# EAGLE design crossover (EAGLE 7.5.0)
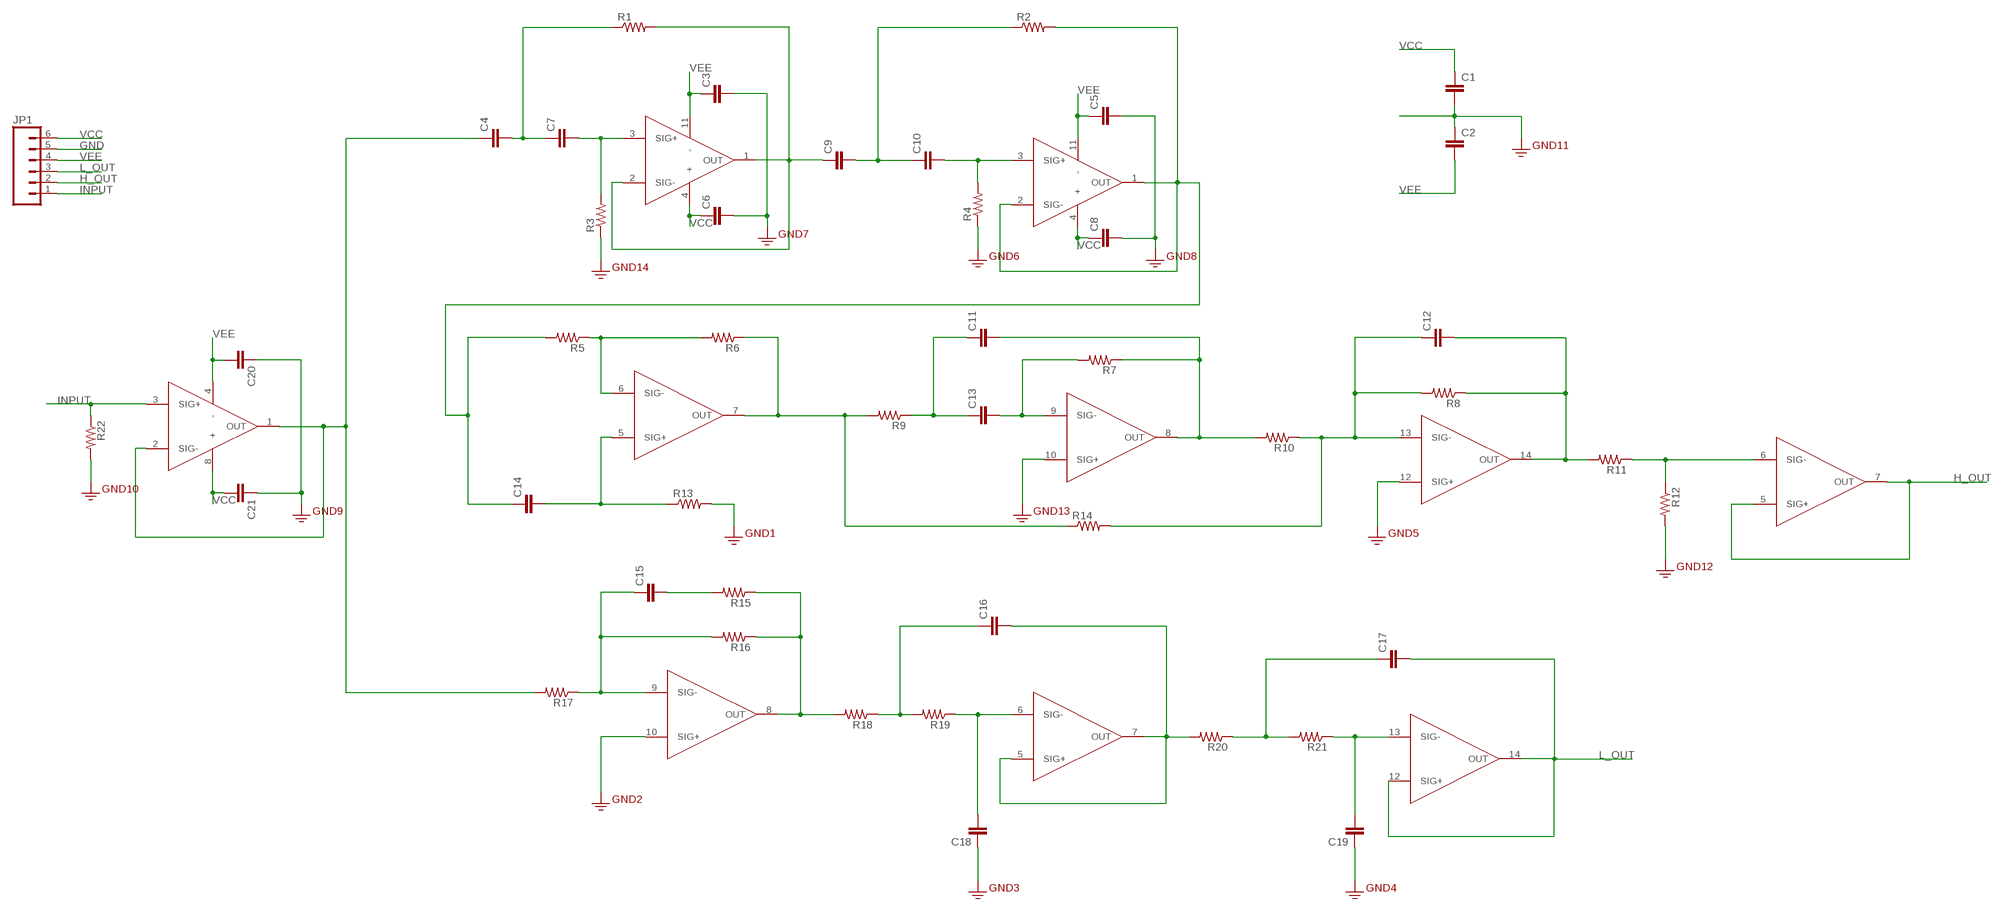
[diagram p0: schematic, sheet 1]

## Parts
C1  CAPEZ  [CAP-PTH-SMALLEZ]
C2  CAPEZ  [CAP-PTH-SMALLEZ]
C3  CAPEZ  [CAP-PTH-SMALLEZ]
C4  CAPEZ  [CAP-PTH-SMALLEZ]
C5  CAPEZ  [CAP-PTH-SMALLEZ]
C6  CAPEZ  [CAP-PTH-SMALLEZ]
C7  CAPEZ  [CAP-PTH-SMALLEZ]
C8  CAPEZ  [CAP-PTH-SMALLEZ]
C9  CAPEZ  [CAP-PTH-SMALLEZ]
C10  CAPEZ  [CAP-PTH-SMALLEZ]
C11  CAPEZ  [CAP-PTH-SMALLEZ]
C12  CAPEZ  [CAP-PTH-SMALLEZ]
C13  CAPEZ  [CAP-PTH-SMALLEZ]
C14  CAPEZ  [CAP-PTH-SMALLEZ]
C15  CAPEZ  [CAP-PTH-SMALLEZ]
C16  CAPEZ  [CAP-PTH-SMALLEZ]
C17  CAPEZ  [CAP-PTH-SMALLEZ]
C18  CAPEZ  [CAP-PTH-SMALLEZ]
C19  CAPEZ  [CAP-PTH-SMALLEZ]
C20  CAPEZ  [CAP-PTH-SMALLEZ]
C21  CAPEZ  [CAP-PTH-SMALLEZ]
JP1  M06SIP  [1X06]
R1  RESISTORPTH-1/4W  [AXIAL-0.4]
R2  RESISTORPTH-1/4W  [AXIAL-0.4]
R3  RESISTORPTH-1/4W  [AXIAL-0.4]
R4  RESISTORPTH-1/4W  [AXIAL-0.4]
R5  RESISTORPTH-1/4W  [AXIAL-0.4]
R6  RESISTORPTH-1/4W  [AXIAL-0.4]
R7  RESISTORPTH-1/4W  [AXIAL-0.4]
R8  RESISTORPTH-1/4W  [AXIAL-0.4]
R9  RESISTORPTH-1/4W  [AXIAL-0.4]
R10  RESISTORPTH-1/4W  [AXIAL-0.4]
R11  RESISTORPTH-1/4W  [AXIAL-0.4]
R12  RESISTORPTH-1/4W  [AXIAL-0.4]
R13  RESISTORPTH-1/4W  [AXIAL-0.4]
R14  RESISTORPTH-1/4W  [AXIAL-0.4]
R15  RESISTORPTH-1/4W  [AXIAL-0.4]
R16  RESISTORPTH-1/4W  [AXIAL-0.4]
R17  RESISTORPTH-1/4W  [AXIAL-0.4]
R18  RESISTORPTH-1/4W  [AXIAL-0.4]
R19  RESISTORPTH-1/4W  [AXIAL-0.4]
R20  RESISTORPTH-1/4W  [AXIAL-0.4]
R21  RESISTORPTH-1/4W  [AXIAL-0.4]
R22  RESISTORPTH-1/4W  [AXIAL-0.4]
U$1  OPA1604STANDARD  [SOIC-14]
U$2  OPA1604STANDARD  [SOIC-14]
U$3  OPA1602  [SOIC8]

## Nets
GND: C1.2 C2.1 C3.2 C5.2 C6.2 C8.2 C18.1 C19.1 C20.1 C21.1 JP1.5 R3.P$1 R4.P$1 R12.P$2 R13.P$2 R22.P$2 U$1.10(SIG+) U$2.10(SIG+) U$2.12(SIG+) ; supply symbol labelled GND2
H_OUT: JP1.2 U$3.5(SIG+) U$3.7(OUT)
INPUT: JP1.1 R22.P$1 U$3.3(SIG+)
L_OUT: C17.2 JP1.3 U$1.12(SIG+) U$1.14(OUT)
N$1: C7.2 R3.P$2 U$1.3(SIG+)
N$2: C9.1 R1.P$2 U$1.1(OUT) U$1.2(SIG-)
N$3: C4.2 C7.1 R1.P$1
N$8: C9.2 C10.1 R2.P$1
N$12: C10.2 R4.P$2 U$2.3(SIG+)
N$15: C11.2 R7.P$1 R10.P$2 U$2.8(OUT)
N$16: C13.2 R7.P$2 U$2.9(SIG-)
N$17: C11.1 C13.1 R9.P$1
N$18: R6.P$1 R9.P$2 R14.P$1 U$2.7(OUT)
N$20: C14.2 R13.P$1 U$2.5(SIG+)
N$21: C14.1 R2.P$2 R5.P$2 U$2.1(OUT) U$2.2(SIG-)
N$22: R5.P$1 R6.P$2 U$2.6(SIG-)
N$23: C12.1 R8.P$2 R10.P$1 R14.P$2 U$2.13(SIG-)
N$25: C12.2 R8.P$1 R11.P$2 U$2.14(OUT)
N$26: R11.P$1 R12.P$1 U$3.6(SIG-)
N$29: C15.1 R16.P$2 R17.P$1 U$1.9(SIG-)
N$30: C15.2 R15.P$2
N$31: R15.P$1 R16.P$1 R18.P$2 U$1.8(OUT)
N$33: C16.1 R18.P$1 R19.P$2
N$34: C18.2 R19.P$1 U$1.6(SIG-)
N$35: C16.2 R20.P$2 U$1.5(SIG+) U$1.7(OUT)
N$36: C17.1 R20.P$1 R21.P$2
N$38: C19.2 R21.P$1 U$1.13(SIG-)
N$42: C4.1 R17.P$2 U$3.1(OUT) U$3.2(SIG-)
VCC: C1.1 C6.1 C8.1 C21.2 JP1.6 U$1.4(+) U$2.4(+) U$3.8(+)
VEE: C2.2 C3.1 C5.1 C20.2 JP1.4 U$1.11(-) U$2.11(-) U$3.4(-)

## Library data of the parts
C1-C21 = SparkFun-Passives:CAP: Capacitor Standard 0603 ceramic capacitor, and 0.1" leaded capacitor.
JP1 = SparkFun-Connectors:M06: Header 6 Standard 6-pin 0.1" header. Use with straight break away headers (SKU : PRT-00116), right angle break away headers (PRT-00553), swiss pins (PRT-00743), machine pins (PRT-00117), and female headers (PRT-00115). Molex polarized connector foot print use with SKU : PRT-08094 with associated crimp pins and housings. NOTES ON THE VARIANTS LOCK and LOCK_LONGPADS... This footprint was designed to help hold the alignment of a through-hole component (i.e. 6-pin header) while soldering it into place. You may notice that each hole has been shifted either up or down by 0.005 of an inch from it's more standard position (which is a perfectly straight line). This slight alteration caused the pins (the squares in the middle) to touch the edges of the holes. Because they are alternating, it causes a "brace" to hold the component in place. 0.005 has proven to be the perfect amount of "off-center" position when using our standard breakaway headers. Although looks a little odd when you look at the bare footprint, once you have a header in there, the alteration is very hard to notice. Also,if you push a header all the way into place, it is covered up entirely on the bottom side. This idea of altering the position of holes to aid alignment will be further integrated into the Sparkfun Library for other footprints. It can help hold any component with 3 or more connection pins.
R1-R22 = SparkFun-Passives:RESISTOR: Resistor Basic schematic elements and footprints for 0603, 1206, and PTH resistors.
U$1 U$2 = NU STEM:OPA1604
U$3 = NU STEM:OPA1602

## Board
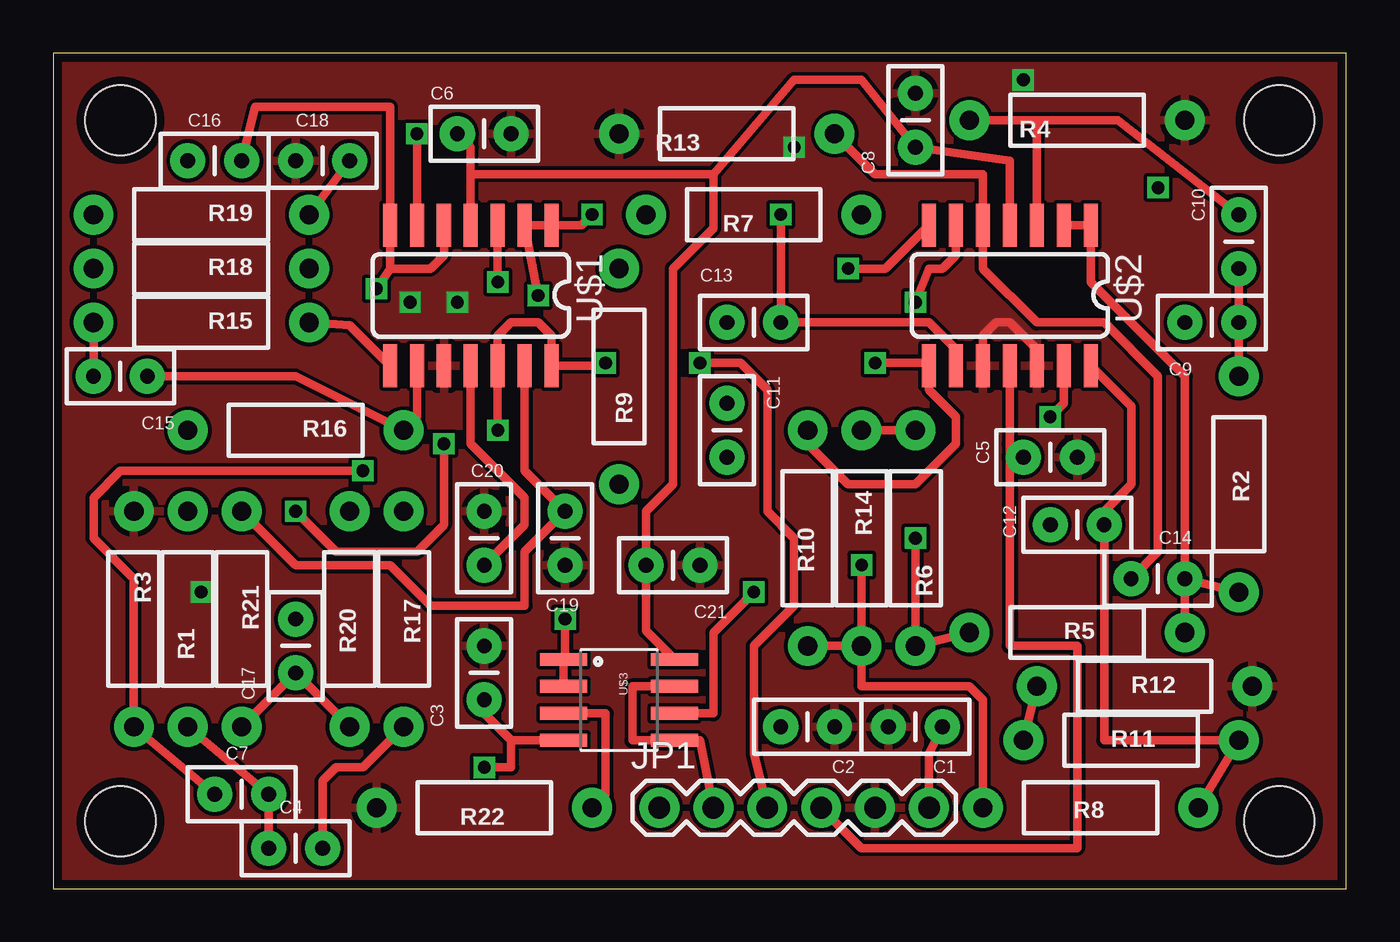
[diagram p1: board, top side]
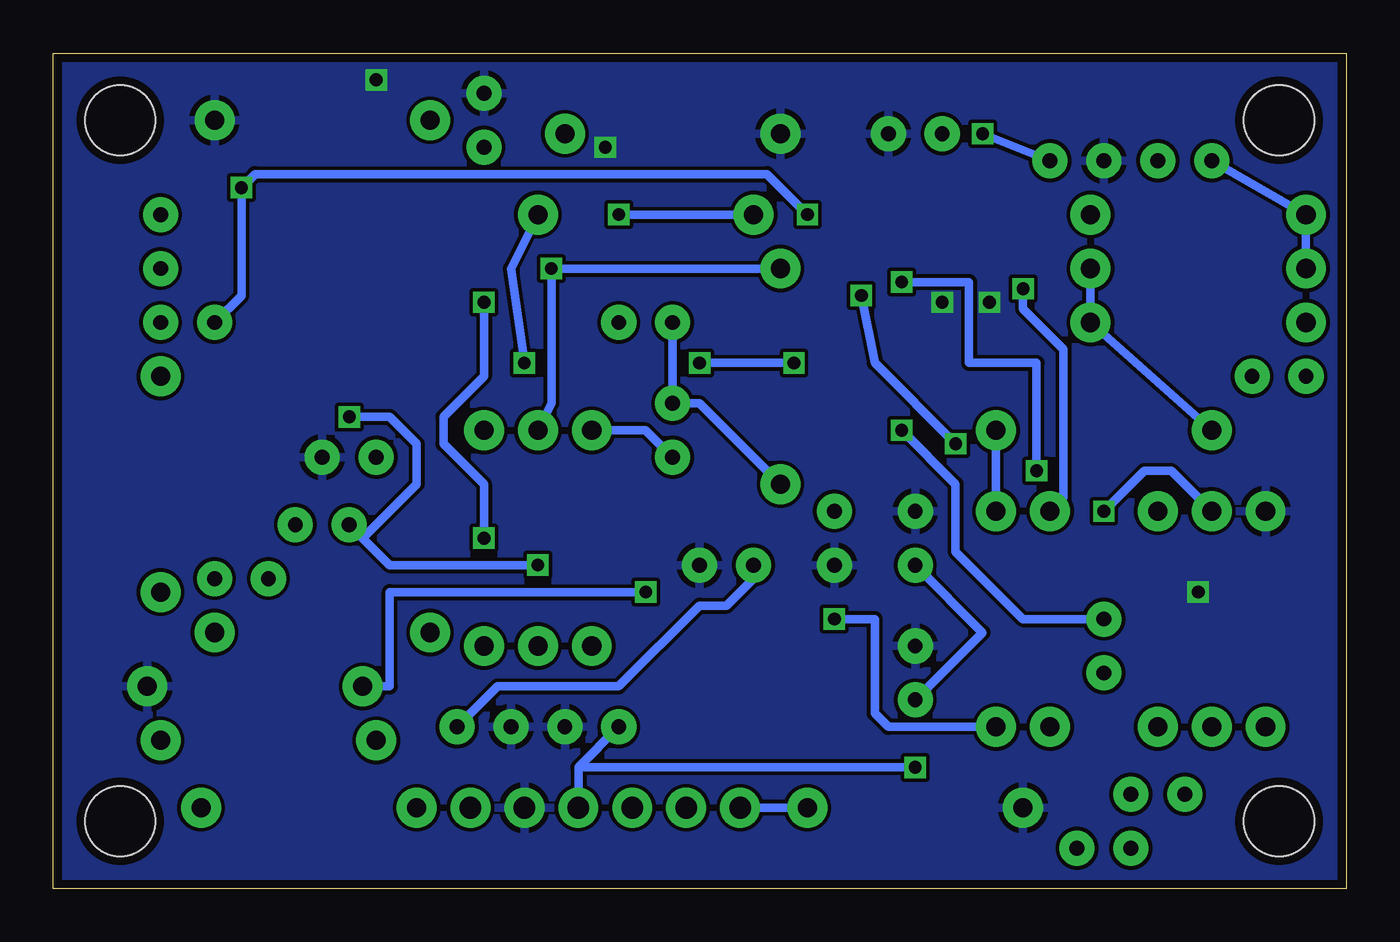
[diagram p2: board, bottom side, seen from below]

Size 60.95 x 39.36 mm. Coordinates in mm from the lower left corner, seen from the top.
Outline: 0,0 60.95,0 60.95,39.36 0,39.36 0,0
Copper layers (1*16): Top 0.035mm / dielectric 1.5mm / Bottom 0.035mm
Design rules "default *": minimum track width 10mil, minimum drill 14mil, track to track 7mil, track to pad 7mil, pad to pad 7mil, via to via 7mil, smd to smd 7mil, copper to edge 16mil, drill to drill 8mil, minimum pad ring 10mil, minimum via ring 8mil, stop-mask expansion 4mil, vias tented up to drill 0mil, thermal gap 10mil

### Footprints (pad centres in the part's own frame; a part is rotated, then mirrored left to right if it is on the bottom)
CAP-PTH-SMALLEZ = drill 0.7 pad 1.651: 1 0,0; 2 2.54,0
1X06 = drill 1.016 pad 1.88: 1 0,0; 2 2.54,0; 3 5.08,0; 4 7.62,0; 5 10.16,0; 6 12.7,0
AXIAL-0.4 = drill 0.9 pad 1.88: P$1 -5.08,0; P$2 5.08,0
SOIC-14 = smd 0.66 x 2.032: 1 -4.445,-3.315; 2 -3.175,-3.315; 3 -1.905,-3.315; 4 -0.635,-3.315; 5 0.635,-3.315; 6 1.905,-3.315; 7 3.175,-3.315; 8 3.175,3.315; 9 1.905,3.315; 10 0.635,3.315; 11 -0.635,3.315; 12 -1.905,3.315; 13 -3.175,3.315; 14 -4.445,3.315
SOIC8 = smd 0.61 x 2.21: 1 -1.905,-2.616; 2 -0.635,-2.616; 3 0.635,-2.616; 4 1.905,-2.616; 5 1.905,2.616; 6 0.635,2.616; 7 -0.635,2.616; 8 -1.905,2.616
STAND-OFF = hole 3.302: 0,0

### Placement (x,y rotation side)
C1  41.91,7.62 180 top
C2  36.83,7.62 180 top
C3  20.32,8.89 90 top
C4  12.7,1.91 180 top
C5  45.72,20.32 0 top
C6  19.05,35.56 0 top
C7  10.16,4.45 180 top
C8  40.64,34.92 90 top
C9  53.34,26.67 0 top
C10  55.88,29.21 90 top
C11  31.75,22.86 270 top
C12  46.99,17.14 0 top
C13  31.75,26.67 0 top
C14  53.34,14.61 180 top
C15  4.45,24.13 180 top
C16  6.35,34.29 0 top
C17  11.43,10.16 90 top
C18  11.43,34.29 0 top
C19  24.13,15.24 90 top
C20  20.32,17.78 270 top
C21  30.48,15.24 180 top
JP1  28.57,3.81 0 top
R1  6.35,12.7 90 top
R2  55.88,19.05 270 top
R3  3.81,12.7 270 top
R4  48.26,36.2 180 top
R5  48.26,12.06 0 top
R6  40.64,16.51 270 top
R7  33.02,31.75 180 top
R8  48.9,3.81 180 top
R9  26.67,24.13 90 top
R10  35.56,16.51 90 top
R11  50.8,6.99 0 top
R12  51.44,9.53 0 top
R13  31.75,35.56 180 top
R14  38.1,16.51 270 top
R15  6.99,26.67 180 top
R16  11.43,21.59 0 top
R17  16.51,12.7 270 top
R18  6.99,29.21 0 top
R19  6.99,31.75 180 top
R20  13.97,12.7 90 top
R21  8.89,12.7 270 top
R22  20.32,3.81 180 top
U$1  19.05,27.94 180 top
U$2  44.45,27.94 180 top
U$3  26.67,8.89 270 top
U$4  [STAND-OFF]  3.17,36.2 0 top
U$5  [STAND-OFF]  57.78,36.2 0 top
U$6  [STAND-OFF]  57.78,3.17 0 top
U$7  [STAND-OFF]  3.17,3.17 0 top

### Tracks (layer width: path | path; a pad name or v marks a point on that pad's centre or on a via)
GND  (via drill 0.6)
  Top 0.406: U$2.10 43.81,26.04 44.45,26.67 45.09,26.67 46.35,25.4 U$2.12
  other vias: 45.72,38.1 34.92,34.92 16.83,27.62 6.99,13.97 19.05,27.62
  pour Top: 0,39.37 60.96,39.37 60.96,0 0,0
  pour Bottom: 0,39.37 60.96,39.37 60.96,0 0,0
H_OUT
  Top 0.406: JP1.2 30.48,6.99 U$3.5 27.3,6.99 27.3,9.53 U$3.7
INPUT
  Top 0.406: R22.P$1 26.04,4.45 26.04,8.26 U$3.3
  Bottom 0.406: R22.P$1 JP1.1
L_OUT  (via drill 0.6)
  Top 0.406: v20.95,21.59 U$1.12 20.95,26.04 21.59,26.67 22.86,26.67 23.5,26.04 U$1.14 25.89,24.62 v26.04,24.77 | JP1.3 33.02,6.35 33.02,11.43 34.92,13.34 34.92,16.51 33.66,17.78 33.66,23.5 32.38,24.77 v30.48,24.77
  Bottom 0.406: v20.95,21.59 18.41,19.05 18.41,15.88 15.24,12.7 C17.2 | v30.48,24.77 v26.04,24.77
N$1  (via drill 0.6)
  Top 0.406: C7.2 R3.P$2 3.81,14.61 1.91,16.51 1.91,18.41 3.17,19.68 v14.61,19.68 | v20.95,28.57 U$1.3
  Bottom 0.406: v14.61,19.68 14.61,24.77 17.78,24.77 17.78,28.57 v20.95,28.57
N$2  (via drill 0.6)
  Top 0.406: v25.4,31.75 24.91,31.25 U$1.1 U$1.2 v22.86,27.94 | v18.41,20.95 18.41,17.14 17.14,15.88 13.34,15.88 v11.43,17.78
  Bottom 0.406: C9.1 52.07,27.94 v52.07,33.02 51.44,33.66 27.3,33.66 v25.4,31.75 | v22.86,27.94 22.23,24.77 v18.41,20.95 | v11.43,17.78 9.53,19.68 8.26,19.68 R1.P$2
N$3
  Top 0.406: R1.P$1 C7.1 C4.2
N$8
  Top 0.406: C10.1 C9.2 R2.P$1
N$12
  Top 0.406: U$2.3 46.35,36.2 | C10.2 50.16,36.2 46.35,36.2 | 46.35,36.2 R4.P$2
N$15  (via drill 0.6)
  Top 0.406: R10.P$2 35.56,20.95 37.47,19.05 40.64,19.05 42.55,20.95 42.55,22.23 41.27,23.5 U$2.8 41.13,24.77 v38.73,24.77
  Bottom 0.406: C11.2 33.02,21.59 R10.P$2 | v38.73,24.77 39.37,29.21 R7.P$1
N$16  (via drill 0.6)
  Top 0.406: v34.29,31.75 C13.2 41.27,26.67 42.55,25.4 U$2.9
  Bottom 0.406: v34.29,31.75 R7.P$2
N$17
  Bottom 0.406: R9.P$1 30.48,22.86 C11.1 C13.1
N$18  (via drill 0.6)
  Top 0.406: R14.P$1 R6.P$1 | U$2.7 39.23,29.21 v37.47,29.21
  Bottom 0.406: R14.P$1 37.47,22.86 v37.47,29.21 R9.P$2
N$20
  Top 0.406: C14.2 52.07,15.88 52.07,24.13 49.53,26.67 46.35,26.67 43.81,29.21 U$2.5 43.81,33.66 38.73,33.66 R13.P$1
N$21
  Top 0.406: U$2.2 U$2.1 48.9,28.57 53.34,24.13 C14.1 | C14.1 R5.P$2 | C14.1 R2.P$2
N$22  (via drill 0.6)
  Top 0.406: R5.P$1 R6.P$2 v40.64,16.51 | U$2.6 42.55,29.84 41.91,29.21 41.27,29.21 v40.64,27.62
  Bottom 0.406: v40.64,27.62 40.64,24.13 42.55,22.23 42.55,20.95 40.64,19.05 v40.64,16.51
N$23  (via drill 0.6)
  Top 0.406: U$2.13 47.62,22.86 v46.99,22.23 | R14.P$2 R10.P$1 | R8.P$2 43.81,8.89 43.18,9.53 38.1,9.53 R14.P$2 | v38.1,15.24 R14.P$2
  Bottom 0.406: v46.99,22.23 45.09,22.23 43.81,20.95 43.81,19.05 46.35,16.51 | 46.35,16.51 C12.1 | 46.35,16.51 45.09,15.24 v38.1,15.24
N$25
  Top 0.406: U$2.14 50.8,22.72 50.8,19.05 49.53,17.78 C12.2 49.53,6.99 R11.P$2 R8.P$1
N$26  (via drill 0.6)
  Top 0.406: R11.P$1 R12.P$1 | v33.02,13.97 31.11,12.06 31.11,8.26 U$3.6
  Bottom 0.406: R12.P$1 45.09,9.53 45.09,13.97 v33.02,13.97
N$29
  Top 0.406: U$1.9 17.14,22.23 R16.P$2 11.43,24.13 C15.1
  Bottom 0.406: R17.P$1 R16.P$2
N$30
  Top 0.406: C15.2 R15.P$2
N$31
  Top 0.406: R15.P$1 13.97,26.53 U$1.8
  Bottom 0.406: R18.P$2 R15.P$1 R16.P$1
N$33
  Bottom 0.406: R18.P$1 R19.P$2 C16.1
N$34  (via drill 0.6)
  Top 0.406: R19.P$1 C18.2 | U$1.6 v17.14,35.56
  Bottom 0.406: v17.14,35.56 C18.2
N$35  (via drill 0.6)
  Top 0.406: 15.88,29.21 U$1.7 15.88,36.83 9.53,36.83 C16.2 | U$1.5 18.41,29.84 17.78,29.21 15.88,29.21 | 15.88,29.21 v15.24,28.26
  Bottom 0.406: v15.24,28.26 15.24,27.3 13.34,25.4 13.34,18.41 R20.P$2
N$36
  Top 0.406: R21.P$2 C17.1 R20.P$1
N$38
  Top 0.406: U$1.13 22.23,19.68 C19.2 22.23,15.88 22.23,13.34 17.78,13.34 15.88,15.24 11.43,15.24 R21.P$1
N$42  (via drill 0.6)
  Top 0.406: C4.1 12.7,5.08 13.34,5.71 14.61,5.71 R17.P$2 | U$3.2 U$3.1 24.13,10.87 v24.13,12.7
  Bottom 0.406: R17.P$2 21.59,7.62 22.23,8.26 22.23,12.7 v24.13,12.7
VCC
  Top 0.406: U$1.4 19.68,33.66 | 19.68,33.66 19.68,34.92 C6.1 | 31.11,33.66 31.11,31.11 29.21,29.21 29.21,19.05 27.94,17.78 C21.2 27.94,12.14 U$3.8 | 31.11,33.66 19.68,33.66 | U$2.4 45.09,34.29 C8.1 38.1,38.1 34.92,38.1 31.11,33.66 | JP1.6 41.27,6.35 C1.1
  Bottom 0.406: C1.1 40.01,9.53 34.29,9.53 30.48,13.34 29.21,13.34 27.94,14.61 C21.2
VEE  (via drill 0.6)
  Top 0.406: U$1.11 19.68,20.95 22.23,18.41 22.23,17.14 C20.2 | U$2.11 45.09,20.95 | 45.09,20.95 C5.1 | C3.1 20.32,8.26 21.59,6.99 | 21.59,6.99 U$3.4 24.13,6.91 | 45.09,20.95 45.09,11.43 48.26,11.43 48.26,1.91 38.1,1.91 JP1.4 | v20.32,5.71 21.59,5.71 21.59,6.99
  Bottom 0.406: C3.1 17.14,12.06 C20.2 | C2.2 36.2,5.71 | 36.2,5.71 JP1.4 | v20.32,5.71 36.2,5.71